# Altium schematic sheet USB_to_UART.SchDoc
size A4
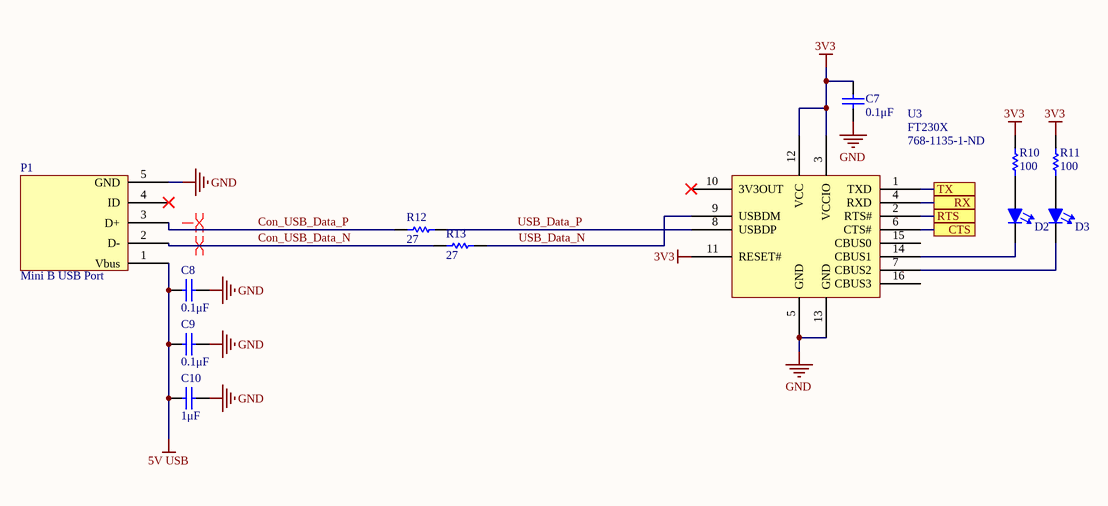
[diagram p0: USB_to_UART.SchDoc]

## Parts
C7  0.1μF  [CAPC1608N(0603")]
C8  0.1μF  [CAPC1608N(0603")]
C9  0.1μF  [CAPC1608N(0603")]
C10  1μF  [CAPC1608N(0603")]
D2  Red  [LED0805]  (value not drawn)
D3  Red  [LED0805]  (value not drawn)
P1  Mini B USB Port  [Mini B USB Footprint]
R10  100  [RESC1608N(0603")]
R11  100  [RESC1608N(0603")]
R12  27  [RESC1608N(0603")]
R13  27  [RESC1608N(0603")]
U3  FT230X  Supplier Part Number 1: 768-1135-1-ND  [SSOP16]

## Ports
CTS, RTS, RX, TX

## Nets
3V3: C7.2(Cathode) R10.2 R11.2 U3.3(VCCIO) U3.11(RESET#) U3.12(VCC)
5V USB: C8.2(Cathode) C9.2(Cathode) C10.2(Cathode) P1.1(Vbus)
GND: C7.1(Anode) C8.1(Anode) C9.1(Anode) C10.1(Anode) P1.5(GND) U3.5(GND) U3.13(GND)
Con_USB_Data_N: P1.2(D-) R13.2
Con_USB_Data_P: P1.3(D+) R12.2
CTS: U3.6(CTS#) ; port CTS
RTS: U3.2(RTS#) ; port RTS
RX: U3.4(RXD) ; port RX
TX: U3.1(TXD) ; port TX
USB_Data_N: R13.1 U3.9(USBDM)
USB_Data_P: R12.1 U3.8(USBDP)
NetD2_1: D2.1(Cathode) U3.14(CBUS1)
NetD2_2: D2.2(Anode) R10.1
NetD3_1: D3.1(Cathode) U3.7(CBUS2)
NetD3_2: D3.2(Anode) R11.1

Not connected (* = marked no-connect by the designer): P1 4(ID)*; U3 10(3V3OUT)* 15(CBUS0) 16(CBUS3)

## Layout directives
differential pair: (no net found under the mark), Con_USB_Data_N

## Library data of the parts
C7-C9 = 0.1uF 100V 0603 SMD, Ceramic: Capacitor, Ceramic, 100V, +/- 10%, 0603 SMD, X7R; MFG: TDK; MFG#: CGA3E3X7S2A104K080AB; Published: 16-04-26; Publisher: AUVic; PackageDescription: Chip Capacitor; Value: 0.1μF; Created By: Ashwin Sira; Supplier 1: Digi-Key; Supplier Part Number 1: 445-6938-1-ND
C10 = 1uF 25V 0603 SMD, Ceramic: Capacitor, Ceramic, 25V, +/- 10%, 0603 SMD, X5R; MFG: Murata-Electronics-North-America; MFG#: GRM188R61E105KA12D; Published: 16-06-27; Publisher: AUVic; PackageDescription: Chip Capacitor; Value: 1μF; Created By: Andy Bates; Supplier 1: Digi-Key; Supplier Part Number 1: 490-3897-1-ND
D2 D3 = LED, 0805 (2012), Red, Clear: Supplier 1: Digi-Key; Supplier Part Number 1: 732-4984-1-ND; Colour: Red; Created By: Ashwin Sira
P1 = Mini B USB Port: Mini B USB Port - Female; Created by: Gabriel Green; Created on: July 5, 2017; Supplier 1: Digi-Key; Supplier Part Number 1: 151-1206-1-ND
R10 R11 = 100R, 1%, 1/10W, 0603 SMD: Made By: Andy Bates; Owned By: AUVic; Created On: 16-09-10; Last Edited: 16-09-10; Value: 100; Supplier 1: Digi-Key; Supplier Part Number 1: 311-100HRCT-ND
R12 R13 = 27 Ohm, 1%, 1/10W , 0603, SMD: Created By: Andy Bates; Publisher: AUVic; Date Created: 2017-10-13; Value: 27; Supplier 1: Digi-Key; Supplier Part Number 1: 311-27.0HRCT-ND
U3 = FTDI - USB to UART: Supplier 1: Digi-Key; Created by: Gabriel Green; Created on: July 5th, 2017